# Altium schematic sheet [03] - MCU and Conn.SchDoc (part 1 of 2)
size A3; DocumentNumber: 3; SheetNumber: 3; SheetTotal: 3
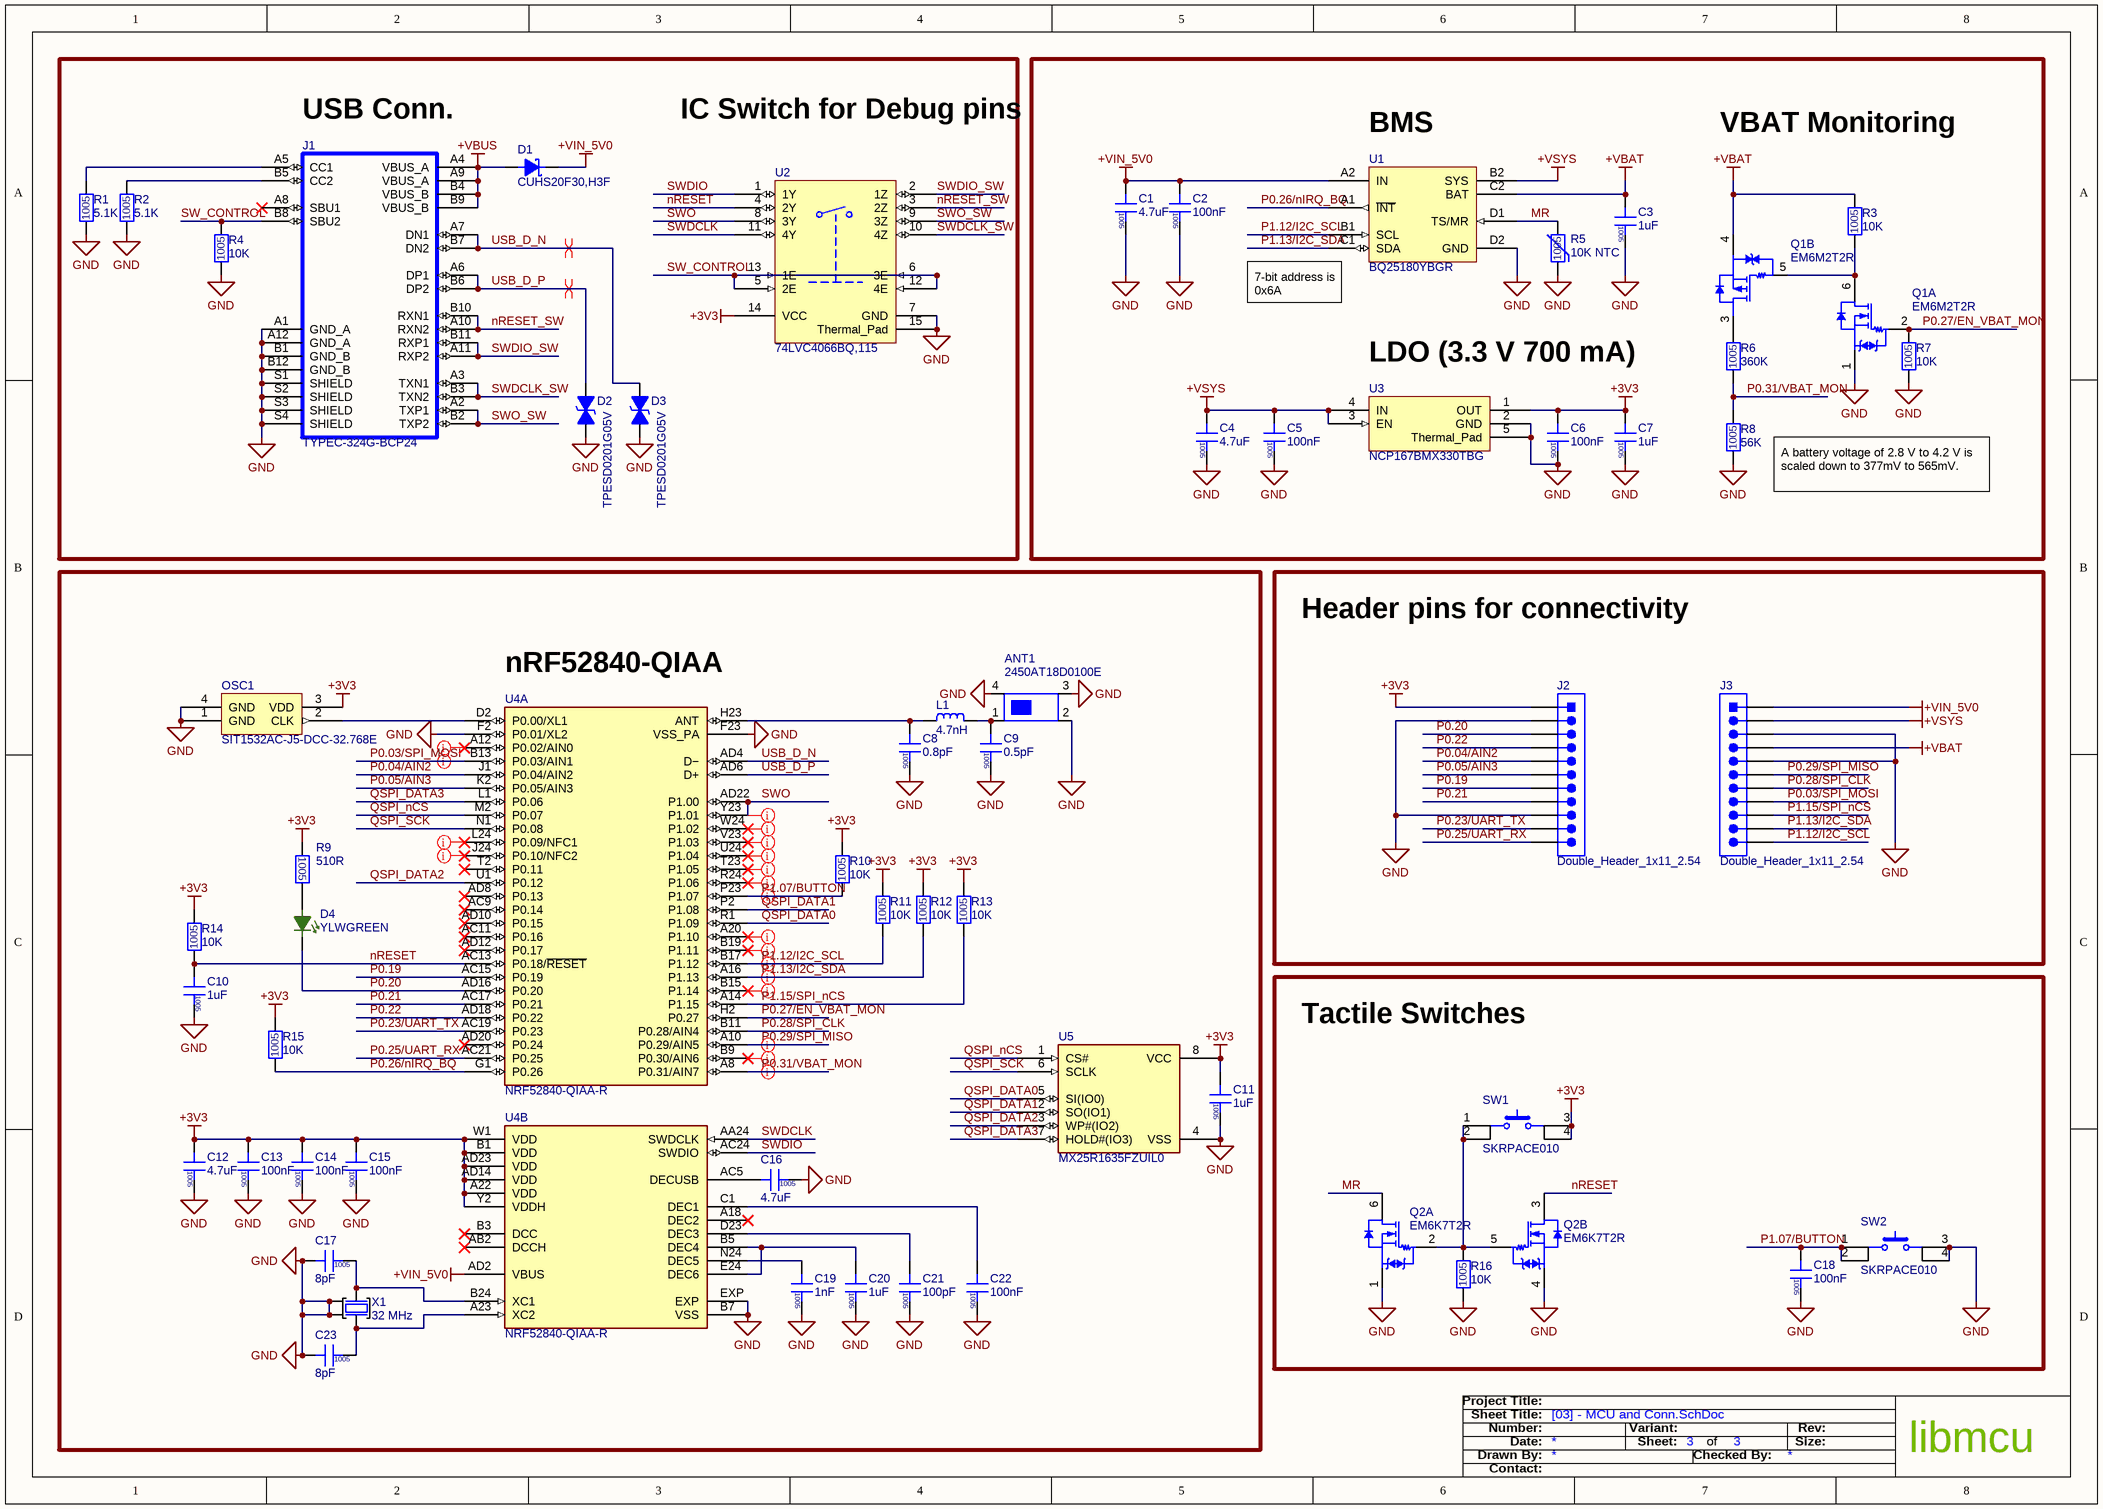
[diagram p0: [03] - MCU and Conn.SchDoc]

## Parts
ANT1  2450AT18D0100E  [2450AT18D0100E]
C1  4.7uF  [CAPC1005X06N]
C2  100nF  [CAPC1005X06N]
C3  1uF  [CAPC1005X06N]
C4  4.7uF  [CAPC1005X06N]
C5  100nF  [CAPC1005X06N]
C6  100nF  [CAPC1005X06N]
C7  1uF  [CAPC1005X06N]
C8  0.8pF  [CAPC1005X06N]
C9  0.5pF  [CAPC1005X06N]
C10  1uF  [CAPC1005X06N]
C11  1uF  [CAPC1005X06N]
C12  4.7uF  [CAPC1005X06N]
C13  100nF  [CAPC1005X06N]
C14  100nF  [CAPC1005X06N]
C15  100nF  [CAPC1005X06N]
C16  4.7uF  [CAPC1005X06N]
C17  8pF  [CAPC1005X06N]
C18  100nF  [CAPC1005X06N]
C19  1nF  [CAPC1005X06N]
C20  1uF  [CAPC1005X06N]
C21  100pF  [CAPC1005X06N]
C22  100nF  [CAPC1005X06N]
C23  8pF  [CAPC1005X06N]
D1  CUHS20F30,H3F  [US2H-DIODE]
D2  TPESD0201G05V  [DIOC0603X03N]
D3  TPESD0201G05V  [DIOC0603X03N]
D4  YLWGREEN  [LDIOC1608X08N]
J1  TYPEC-324G-BCP24  [KUSBX-SMT3-CS-BTR_KYC]
J2  Double_Header_1x11_2.54  [1x11_DOUBLE_HEADER_2.54]  (no BOM)
J3  Double_Header_1x11_2.54  [1x11_DOUBLE_HEADER_2.54]  (no BOM)
L1  4.7nH  [INDC1005X05N]
OSC1  SIT1532AC-J5-DCC-32.768E  [SIT1532]
Q1  EM6M2T2R  [SOTFL50P160X55-6N]  (parts A,B of 2)
Q2  EM6K7T2R  [SOTFL50P160X55-6N]  (parts A,B of 2)
R1  5.1K  [RESC1005X04N]
R2  5.1K  [RESC1005X04N]
R3  10K  [RESC1005X04N]
R4  10K  [RESC1005X04N]
R5  10K NTC  [NTC1005X05N]
R6  360K  [RESC1005X04N]
R7  10K  [RESC1005X04N]
R8  56K  [RESC1005X04N]
R9  510R  [RESC1005X04N]
R10  10K  [RESC1005X04N]
R11  10K  [RESC1005X04N]
R12  10K  [RESC1005X04N]
R13  10K  [RESC1005X04N]
R14  10K  [RESC1005X04N]
R15  10K  [RESC1005X04N]
R16  10K  [RESC1005X04N]
SW1  SKRPACE010  [PTS810]
SW2  SKRPACE010  [PTS810]
U1  BQ25180YBGR  [BGA8C40P2X4_100X155X50_YBG0008]
U2  74LVC4066BQ,115  [QFN50P250X300X100_HS-15N]
U3  NCP167BMX330TBG  [NCP167]
U4  NRF52840-QIAA-R  [NORDIC_NRF52840-QIAA-R7]  (parts A,B of 2)
U5  MX25R1635FZUIL0  [USON8_3X2]
X1  32 MHz  [XT2016_ECS]

## Blocks framed on the sheet
nRF52840-QIAA: ANT1 C8-C17 C19-C23 D4 L1 OSC1 R9-R15 U4 U5 X1
Header pins for connectivity: J2 J3
Tactile Switches: C18 Q2 R16 SW1 SW2

## Nets
+3V3: C6.2 C7.2 C11.2 C12.2 C13.2 C14.2 C15.2 J2.1 OSC1.3(VDD) R9.2 R10.2 R11.2 R12.2 R13.2 R14.2 R15.2 SW1.3 SW1.4 U2.14(VCC) U3.1(OUT) U4.A22(VDD) U4.AD14(VDD) U4.AD23(VDD) U4.B1(VDD) U4.W1(VDD) U4.Y2(VDDH) U5.8(VCC)
+VBAT: C3.2 J3.4 Q1.4(S) R3.2 U1.C2(BAT)
+VBUS: D1.2(Anode) J1.A4(VBUS_A) J1.A9(VBUS_A) J1.B4(VBUS_B) J1.B9(VBUS_B)
+VIN_5V0: C1.2 C2.2 D1.1(Cathode) J3.1 U1.A2(IN) U4.AD2(VBUS)
+VSYS: C4.2 C5.2 J3.2 U1.B2(SYS) U3.3(EN) U3.4(IN)
GND: ANT1.2(GND) ANT1.3(GND) ANT1.4(GND) C1.1 C2.1 C3.1 C4.1 C5.1 C6.1 C7.1 C8.1 C9.1 C10.1 C11.1 C12.1 C13.1 C14.1 C15.1 C16.1 C17.2 C18.1 C19.1 C20.1 C21.1 C22.1 C23.2 D2.2 D3.2 J1.A1(GND_A) J1.A12(GND_A) J1.B1(GND_B) J1.B12(GND_B) J1.S1(SHIELD) J1.S2(SHIELD) J1.S3(SHIELD) J1.S4(SHIELD) J2.2 J2.9 J3.3 J3.5 OSC1.1(GND) OSC1.4(GND) Q1.1(S) Q2.1(S) Q2.4(S) R1.1 R2.1 R4.1 R5.1 R7.1 R8.1 R16.1 SW2.3 SW2.4 U1.D2(GND) U2.7(GND) U2.15(Thermal_Pad) U3.2(GND) U3.5(Thermal_Pad) U4.B7(VSS) U4.EXP U4.F2(P0.01/XL2) U4.F23(VSS_PA) U5.4(VSS) X1.2(GND) X1.4(GND)
MR: Q2.6(D) R5.2 U1.D1(TS/MR)
nRESET: C10.2 Q2.3(D) R14.1 U2.4(2Y) U4.AC13(P0.18/~{RESET})
nRESET_SW: J1.A10(RXN2) J1.B10(RXN1) U2.3(2Z)
P0.03/SPI_MOSI: J3.8 U4.B13(P0.03/AIN1)
P0.04/AIN2: J2.5 U4.J1(P0.04/AIN2)
P0.05/AIN3: J2.6 U4.K2(P0.05/AIN3)
P0.19: J2.7 U4.AC15(P0.19)
P0.20: D4.K J2.3 U4.AD16(P0.20)
P0.21: J2.8 U4.AC17(P0.21)
P0.22: J2.4 U4.AD18(P0.22)
P0.23/UART_TX: J2.10 U4.AC19(P0.23)
P0.25/UART_RX: J2.11 U4.AC21(P0.25)
P0.26/nIRQ_BQ: R15.1 U1.A1(~{INT}) U4.G1(P0.26)
P0.27/EN_VBAT_MON: Q1.2(G) R7.2 U4.H2(P0.27)
P0.28/SPI_CLK: J3.7 U4.B11(P0.28/AIN4)
P0.29/SPI_MISO: J3.6 U4.A10(P0.29/AIN5)
P0.31/VBAT_MON: R6.1 R8.2 U4.A8(P0.31/AIN7)
P1.07/BUTTON: C18.2 R10.1 SW2.1 SW2.2 U4.P23(P1.07)
P1.12/I2C_SCL: J3.11 R11.1 U1.B1(SCL) U4.B17(P1.12)
P1.13/I2C_SDA: J3.10 R12.1 U1.C1(SDA) U4.A16(P1.13)
P1.15/SPI_nCS: J3.9 R13.1 U4.A14(P1.15)
QSPI_DATA0: U4.R1(P1.09) U5.5(SI(IO0))
QSPI_DATA1: U4.P2(P1.08) U5.2(SO(IO1))
QSPI_DATA2: U4.U1(P0.12) U5.3(WP#(IO2))
QSPI_DATA3: U4.L1(P0.06) U5.7(HOLD#(IO3))
QSPI_nCS: U4.M2(P0.07) U5.1(CS#)
QSPI_SCK: U4.N1(P0.08) U5.6(SCLK)
SW_CONTROL: J1.B8(SBU2) R4.2 U2.5(2E) U2.6(3E) U2.12(4E) U2.13(1E)
SWDCLK: U2.11(4Y) U4.AA24(SWDCLK)
SWDCLK_SW: J1.A3(TXN1) J1.B3(TXN2) U2.10(4Z)
SWDIO: U2.1(1Y) U4.AC24(SWDIO)
SWDIO_SW: J1.A11(RXP2) J1.B11(RXP1) U2.2(1Z)
SWO: U2.8(3Y) U4.AD22(P1.00) U4.Y23(P1.01)
SWO_SW: J1.A2(TXP1) J1.B2(TXP2) U2.9(3Z)
USB_D_N: D3.1 J1.A7(DN1) J1.B7(DN2) U4.AD4(D−)
USB_D_P: D2.1 J1.A6(DP1) J1.B6(DP2) U4.AD6(D+)
NetANT1_1: ANT1.1(FEED) C9.2 L1.2
NetC8_2: C8.2 L1.1 U4.H23(ANT)
NetC16_2: C16.2 U4.AC5(DECUSB)
NetC17_1: C17.1 U4.B24(XC1) X1.1(IN)
NetC19_2: C19.2 U4.N24(DEC5)
NetC20_2: C20.2 U4.B5(DEC4) U4.E24(DEC6)
NetC21_2: C21.2 U4.D23(DEC3)
NetC22_2: C22.2 U4.C1(DEC1)
NetC23_1: C23.1 U4.A23(XC2) X1.3(OUT)
NetD4_A: D4.A R9.1
NetJ1_A5: J1.A5(CC1) R1.2
NetJ1_B5: J1.B5(CC2) R2.2
NetOSC1_2: OSC1.2(CLK) U4.D2(P0.00/XL1)
NetQ1_3: Q1.3(D) R6.2
NetQ1_5: Q1.5(G) Q1.6(D) R3.1
NetQ2_2: Q2.2(G) Q2.5(G) R16.2 SW1.1 SW1.2

Not connected (* = marked no-connect by the designer): J1 A8(SBU1)*; U4 A12(P0.02/AIN0)* A18(DEC2)* A20(P1.10)* AB2(DCCH)* AC9(P0.14)* AC11(P0.16)* AD8(P0.13)* AD10(P0.15)* AD12(P0.17)* AD20(P0.24)* B3(DCC)* B9(P0.30/AIN6)* B15(P1.14)* B19(P1.11)* J24(P0.10/NFC2)* L24(P0.09/NFC1)* R24(P1.06)* T2(P0.11)* T23(P1.05)* U24(P1.04)* V23(P1.03)* W24(P1.02)*

## Layout directives
differential pair; differential pair class DIFF90: USB_D_N, USB_D_P
net class GPIO Restrictions: NetU4_A12, NetU4_A20, NetU4_B9, NetU4_B15, NetU4_B19, NetU4_J24, NetU4_L24, NetU4_R24, NetU4_T23, NetU4_U24, NetU4_V23, NetU4_W24, P0.03/SPI_MOSI, P0.29/SPI_MISO, P0.31/VBAT_MON, P1.07/BUTTON, P1.12/I2C_SCL, P1.13/I2C_SDA, SWO

## Notes on the sheet
- (near J1) USB Conn.
- IC Switch for Debug pins
- (near U1) BMS
- VBAT Monitoring
- (near U1) 7-bit address is 0x6A
- LDO (3.3 V 700 mA)
- (near R8) A battery voltage of 2.8 V to 4.2 V is scaled down to 377mV to 565mV.
- Project Title:
- Number:
- Date:
- Sheet Title:
- Drawn By:
- Sheet:
- Variant:
- of
- Checked By:
- Rev:
- Size:
- libmcu
- Contact:
- (in symbol CC0402CRNPO9BN8R0) 1005